# EAGLE design schematic (EAGLE 9.2.0)
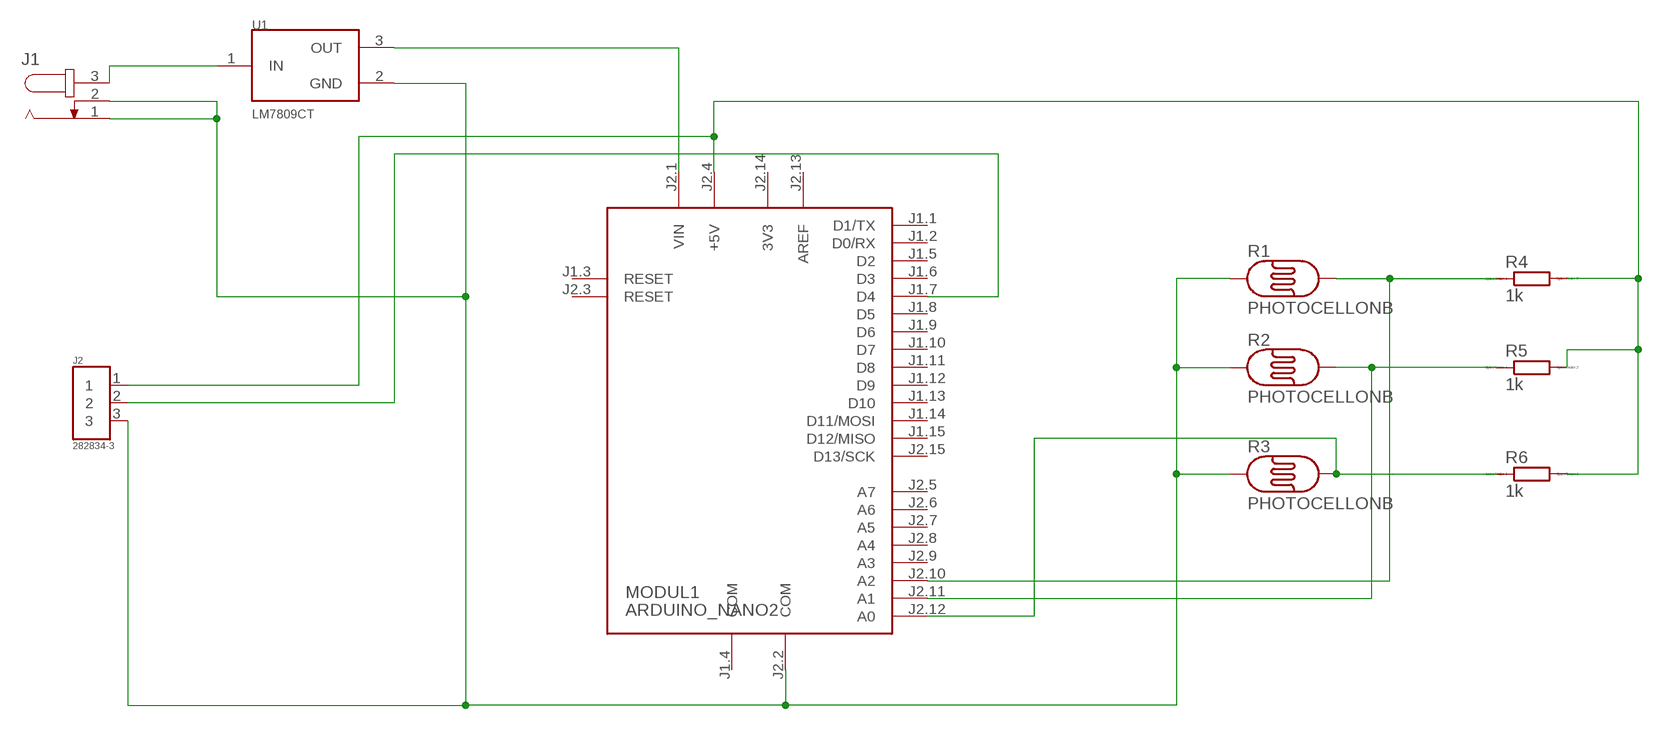
[diagram p0: schematic, sheet 1]

## Parts
J1  JACK-PLUG1  [SPC4078]
J2  282834-3  [TE_282834-3]
MODUL1  ARDUINO_NANO2  [ARDUINO_NANO2]
R1  PHOTOCELLONB  [ON_BOARD]
R2  PHOTOCELLONB  [ON_BOARD]
R3  PHOTOCELLONB  [ON_BOARD]
R4  1k  R0207/10  [0207/10]
R5  1k  R0207/10  [0207/10]
R6  1k  R0207/10  [0207/10]
U1  LM7809CT  [TO254P470X1016X1879-3P]

## Nets
N$1: MODUL1.J2.10(A2) R1.2 R4.1
N$2: MODUL1.J2.11(A1) R2.2 R5.1
N$3: MODUL1.J2.12(A0) R3.2 R6.1
N$4: J1.1 J1.2 J2.3 MODUL1.J2.2(COM) R1.1 R2.1 R3.1 U1.2(GND)
N$6: J2.1 MODUL1.J2.4(+5V) R4.2 R5.2 R6.2
N$7: MODUL1.J2.1(VIN) U1.3(OUT)
N$9: J1.3 U1.1(IN)
N$11: J2.2 MODUL1.J1.7(D4)
Unconnected: MODUL1.J1.1(D1/TX) MODUL1.J1.2(D0/RX) MODUL1.J1.3(RESET) MODUL1.J1.5(D2) MODUL1.J1.6(D3) MODUL1.J1.8(D5) MODUL1.J1.9(D6) MODUL1.J1.10(D7) MODUL1.J1.11(D8) MODUL1.J1.12(D9) MODUL1.J1.13(D10) MODUL1.J1.14(D11/MOSI) MODUL1.J1.15(D12/MISO) MODUL1.J2.3(RESET) MODUL1.J2.5(A7) MODUL1.J2.6(A6) MODUL1.J2.7(A5) MODUL1.J2.8(A4) MODUL1.J2.9(A3) MODUL1.J2.15(D13/SCK)

## Power pins joined to a net without a drawn wire
3V3: MODUL1.J2.14(3V3)
AREF: MODUL1.J2.13(AREF)
COM: MODUL1.J1.4(COM)

## Library data of the parts
J1 = con-jack:JACK-PLUG: DC POWER JACK Power Jack, DC, Right Angle, Through Hole, Rated 5A at 16VDC, PC Terminals Distributor: Farnell (www.Farnell.de) Drawing: 84N1161.pdf / 84N1162.pdf Manufacturer: SPC Technology (www.spctechnology.com) Type: SPC4077 / SPC 4078; OC_FARNELL: unknown; OC_NEWARK: unknown
J2 = 282834-3:282834-3: Conn; Term Blk; PCB; Wire Receptacle; 3; 2.54mm; 30-16AWG; Green; 10A; 150V; M1.6 Check availability <https://pricing.snapeda.com/parts/282834-3/TE%20Connectivity/view-part?ref=eda>; AVAILABILITY: In Stock; COMMENT: 282834-3; DESCRIPTION: 3 Position Wire to Board Terminal Block Horizontal with Board 0.100 (2.54mm); EU_ROHS_COMPLIANCE: Compliant with Exemptions; MF: TE Connectivity; MP: 282834-3; PACKAGE: None; PRICE: None; PURCHASE-URL: https://pricing.snapeda.com/search/part/282834-3/?ref=eda
MODUL1 = arduino:ARDUINO_NANO2: Arduino Nano2 Auto generated by modulcreator.ulp \;; ANZAHL: 2; MODUL: TRUE; STECKX0: -76200; STECKX1: 76200; STECKY0: 177800; STECKY1: 177800
R1-R3 = LDR:PHOTOCELL: Photo Resitor
R4-R6 = eagle-ltspice:R: RESISTOR, European symbol; SPICEMODEL: NONE; SPICEPREFIX: R
U1 = LM7809CT:LM7809CT: Standard Regulator Pos 9V 1A 3-Pin(3+Tab) TO-220AB Rail Check availability <https://pricing.snapeda.com/parts/LM7809CT/ON%20Semiconductor/view-part?ref=eda>; AVAILABILITY: In Stock; DESCRIPTION: Linear Voltage Regulator IC Positive Fixed 1 Output 1A TO-220-3; MF: ON Semiconductor; MP: LM7809CT; PACKAGE: TO-220-3 ON Semiconductor; PRICE: None; PURCHASE-URL: https://pricing.snapeda.com/search/part/LM7809CT/?ref=eda

## Board
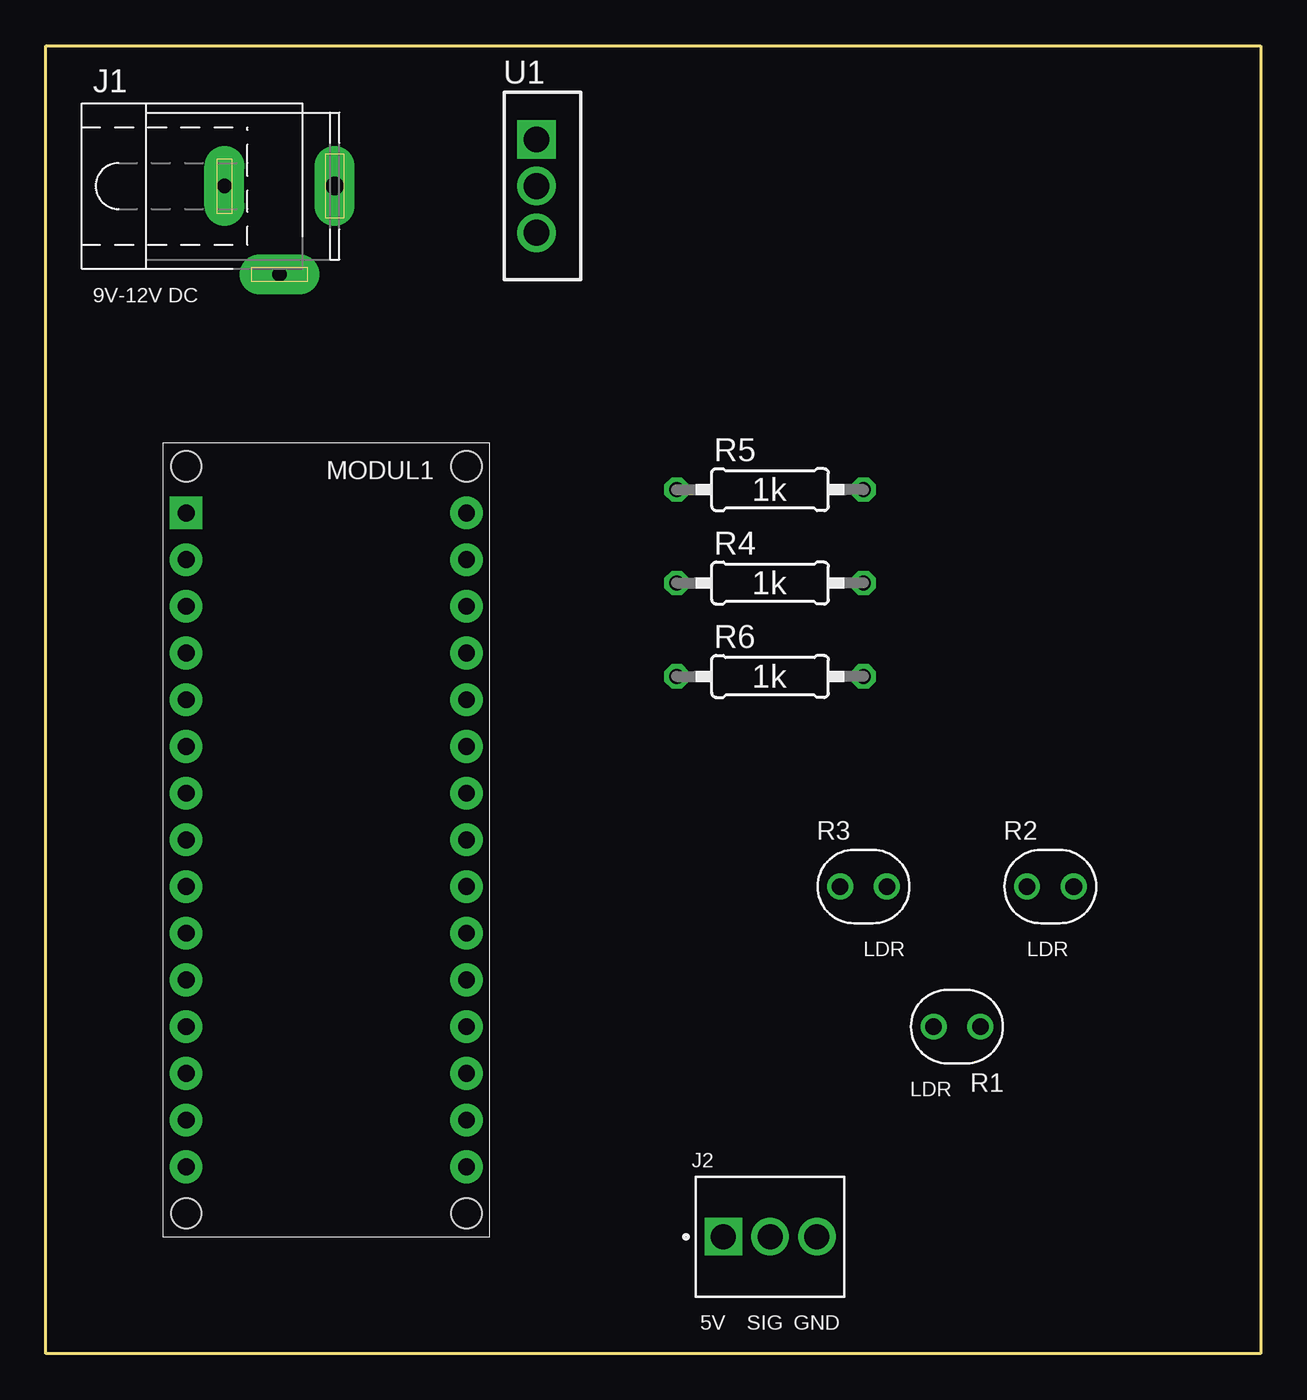
[diagram p1: board, top side]
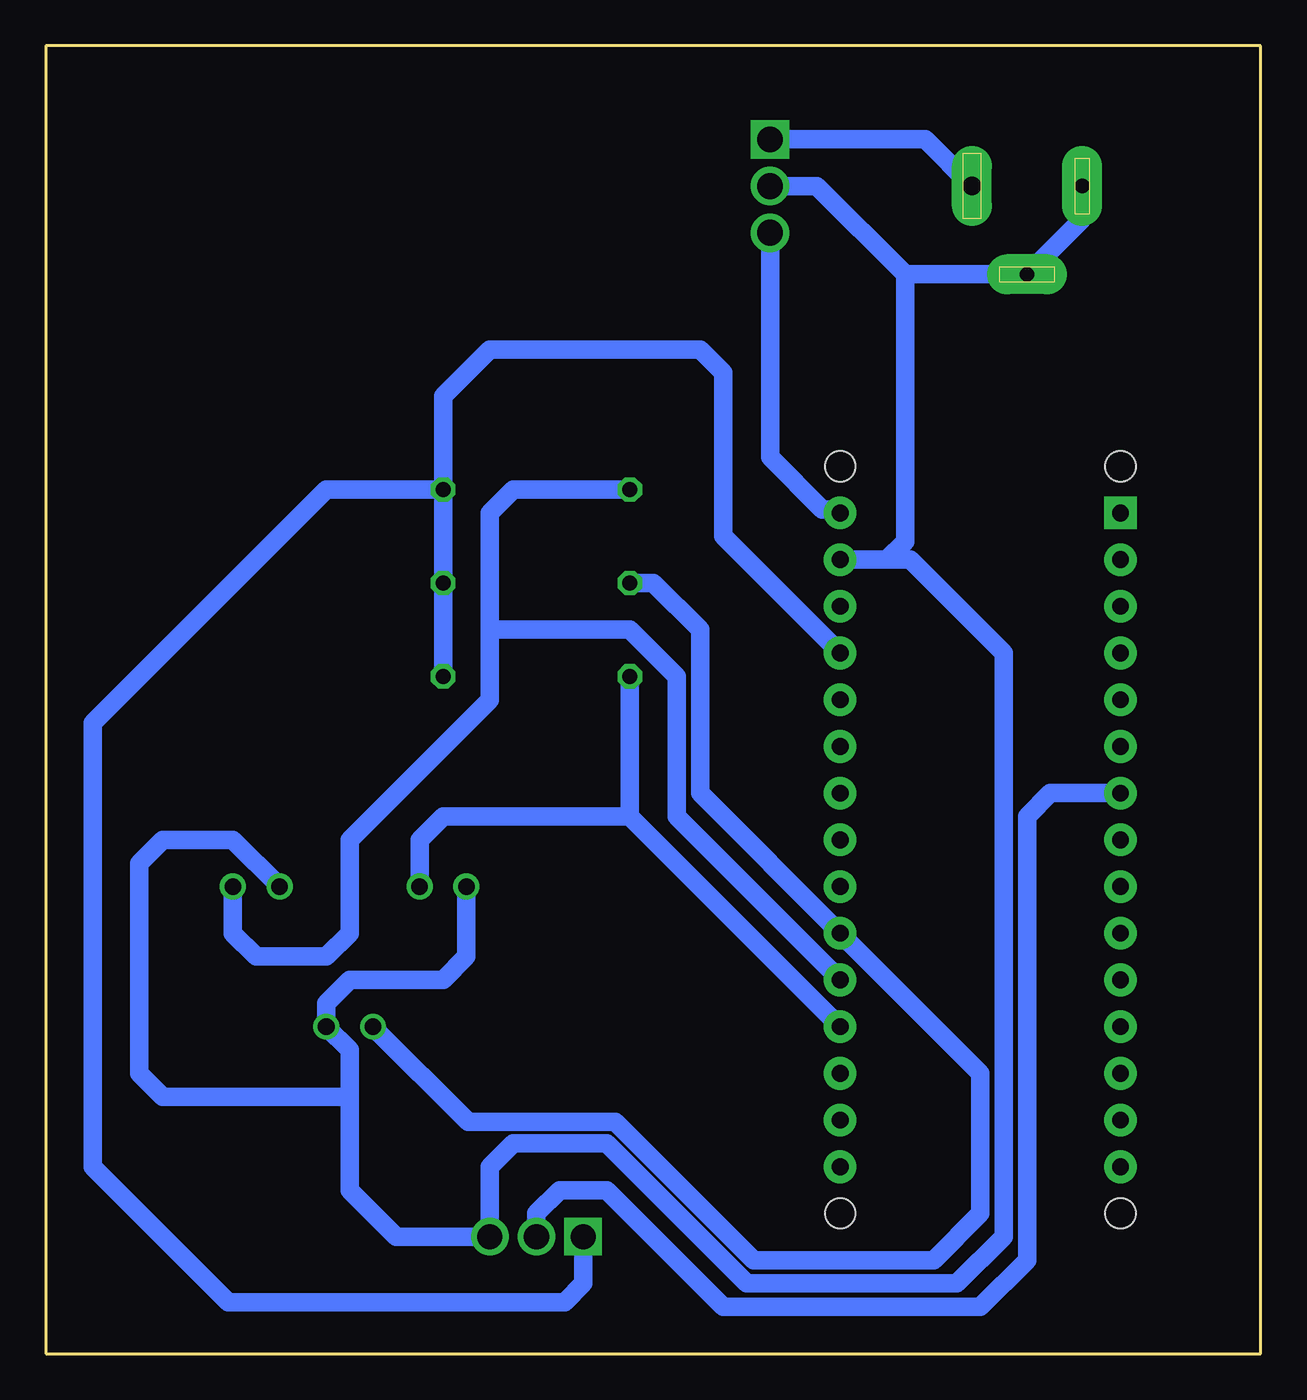
[diagram p2: board, bottom side, seen from below]

Size 66.04 x 71.12 mm. Coordinates in mm from the lower left corner, seen from the top.
Outline: 0,71.12 0,1.27
Outline: 0,71.12 66.04,71.12 66.04,0 0,0 0,71.12
Copper layers (1*16): Top 0.035mm / dielectric 1.5mm / Bottom 0.035mm
Design rules "default": minimum track width 6mil, minimum drill 0.35mm, track to track 6mil, track to pad 6mil, pad to pad 6mil, via to via 6mil, smd to smd 6mil, copper to edge 40mil, drill to drill 6mil, minimum pad ring 10mil, minimum via ring 8mil, stop-mask expansion 4mil, vias tented up to drill 0mil, thermal gap 10mil

### Footprints (pad centres in the part's own frame; a part is rotated, then mirrored left to right if it is on the bottom)
SPC4078 = drill 0.8 pad 2.184 long: 1 -3,0; 2 0,-4.8 | drill 1 pad 2.184 long: 3 3,0
TE_282834-3 = drill 1.36 square: 1 0,0 | drill 1.36: 2 2.54,0; 3 5.08,0
ARDUINO_NANO2 = drill 0.914 pad 1.778 square: J1.1 -7.62,17.78 | drill 0.914 pad 1.778: J1.2 -7.62,15.24; J1.3 -7.62,12.7; J1.4 -7.62,10.16; J1.5 -7.62,7.62; J1.6 -7.62,5.08; J1.7 -7.62,2.54; J1.8 -7.62,0; J1.9 -7.62,-2.54; J1.10 -7.62,-5.08; J1.11 -7.62,-7.62; J1.12 -7.62,-10.16; J1.13 -7.62,-12.7; J1.14 -7.62,-15.24; J1.15 -7.62,-17.78; J2.1 7.62,17.78; J2.2 7.62,15.24; J2.3 7.62,12.7; J2.4 7.62,10.16; J2.5 7.62,7.62; J2.6 7.62,5.08; J2.7 7.62,2.54; J2.8 7.62,0; J2.9 7.62,-2.54; J2.10 7.62,-5.08; J2.11 7.62,-7.62; J2.12 7.62,-10.16; J2.13 7.62,-12.7; J2.14 7.62,-15.24; J2.15 7.62,-17.78 | hole 1.651: -7.62,-20.32; 7.62,-20.32; 7.62,20.32; -7.62,20.32
ON_BOARD = drill 0.9: 1 -1.27,0; 2 1.27,0
0207/10 = drill 0.813 octagon: 1 -5.08,0; 2 5.08,0
TO254P470X1016X1879-3P = drill 1.4 pad 2.1 square: 1 0,0 | drill 1.4 pad 2.1: 2 0,-2.54; 3 0,-5.08

### Placement (x,y rotation side)
J1  12.7,63.5 0 top
J2  36.83,6.35 0 top
MODUL1  15.24,27.94 0 top
R1  49.53,17.78 180 top
R2  54.61,25.4 0 top
R3  44.45,25.4 0 top
R4  39.37,41.91 0 top
R5  39.37,46.99 0 top
R6  39.37,36.83 0 top
U1  26.67,66.04 0 top

### Tracks (layer width: path | path; a pad name or v marks a point on that pad's centre or on a via)
N$1
  Bottom 1.016: R1.2 43.08,12.6 35.08,12.6 27.56,5.08 17.78,5.08 15.24,7.62 15.24,15.24 MODUL1.J2.10 30.48,30.48 30.48,39.37 33.02,41.91 R4.1
N$2
  Bottom 1.016: R5.1 40.64,46.99 41.91,45.72 41.91,39.37 | 41.91,39.37 41.91,35.56 49.53,27.94 49.53,22.86 50.8,21.59 54.61,21.59 55.88,22.86 R2.2 | MODUL1.J2.11 31.75,29.21 31.75,36.83 34.29,39.37 41.91,39.37
N$3
  Bottom 1.016: MODUL1.J2.12 34.29,29.21 | 34.29,29.21 R6.1 | 34.29,29.21 44.45,29.21 45.72,27.94 R3.2
N$4
  Bottom 1.016: J1.1 9.7,61.7 J1.2 19.33,58.7 | 19.33,58.7 24.13,63.5 U1.2 | R3.1 43.18,21.59 44.45,20.32 49.53,20.32 50.8,19.05 R1.1 49.53,16.51 49.53,13.97 | R2.1 55.88,27.94 59.69,27.94 60.96,26.67 60.96,15.24 59.69,13.97 49.53,13.97 | 49.53,13.97 49.53,8.89 46.99,6.35 J2.3 41.91,10.16 40.64,11.43 35.56,11.43 27.94,3.81 16.51,3.81 13.97,6.35 13.97,38.1 19.05,43.18 20.32,43.18 | 20.32,43.18 MODUL1.J2.2 | 20.32,43.18 19.33,44.17 19.33,58.7
N$6
  Bottom 1.016: R6.2 R4.2 R5.2 | J2.1 36.83,3.81 37.85,2.79 56.13,2.79 63.5,10.16 63.5,34.29 50.8,46.99 R5.2 | MODUL1.J2.4 29.21,44.45 29.21,53.34 30.48,54.61 41.91,54.61 44.45,52.07 R5.2
N$7
  Bottom 1.016: MODUL1.J2.1 23.05,45.91 23.83,45.91 26.67,48.75 U1.3
N$9
  Bottom 1.016: J1.3 18.24,66.04 U1.1
N$11
  Bottom 1.016: MODUL1.J1.7 11.43,30.48 12.7,29.21 12.7,5.08 15.24,2.54 29.21,2.54 35.56,8.89 38.1,8.89 39.37,7.62 J2.2

### Text on the board
tNames: 9V-12V DC | LDR | LDR | LDR | 5V | SIG | GND